# Altium schematic sheet E-05 LPDDR4_x.SchDoc: FRDM-IMX93
size 513 x 386 mm; DrawnBy: FORLINX; Organization: ORGANIZATION; Address1: ADDRESS 1; Address2: ADDRESS 2; Address3: ADDRESS 3; Address4: ADDRESS 4; Revision: -; ENG_APP_DATE: --/--/--; DSN_APP_DATE: --/--/--; CHK_APP_DATE: --/--/--; Classification: Public, Company Internal/Proprietary, Company Confidential,  Company Secret; Page Create Date: March  8, 1995; OrgName: NXP Semiconductor; FIUO: A; OrgAddr1: NO. 192 Liangjing Rd. Pudong New Area, ShangHai; Page Number: 5; PageTitle: LPDDR4/x; Page Size: C; Page Count: 23; Designer: FORLINX; RevCode: B1; Approver: NXP SE; Doc: SCH-94611 PDF: SPF-94611; DsnPath: T:\FILES\Designs\Single Board Computers\i.MX93-FRDM\Design Files\SCH-94611_B1.DSN; SchematicName: FRDM-i.MX 93 Development Board; PageName: E-05 LPDDR4/x; PageSize: C; TopSchematic: True
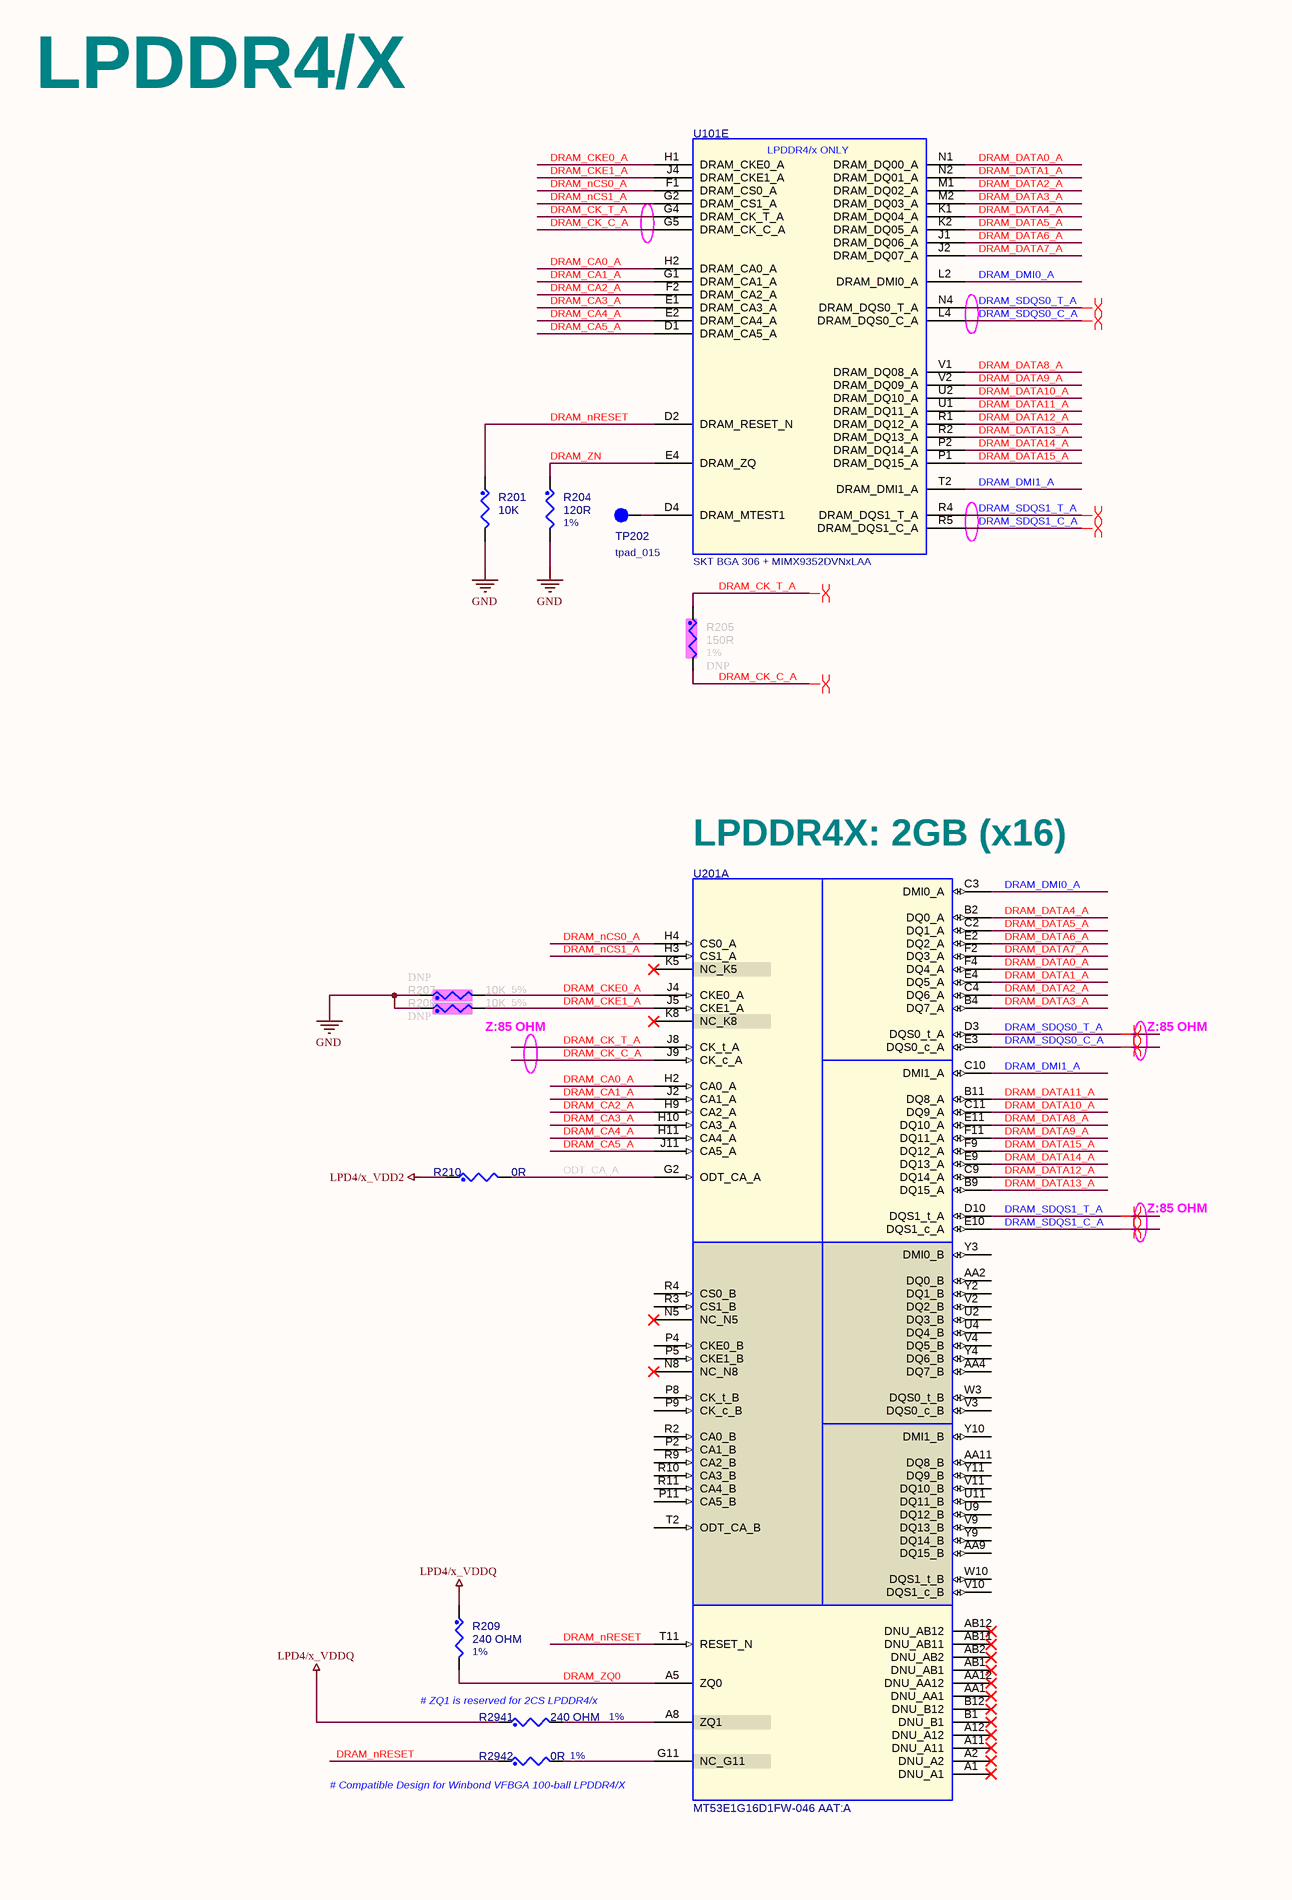
[diagram p0: E-05 LPDDR4_x.SchDoc, left]
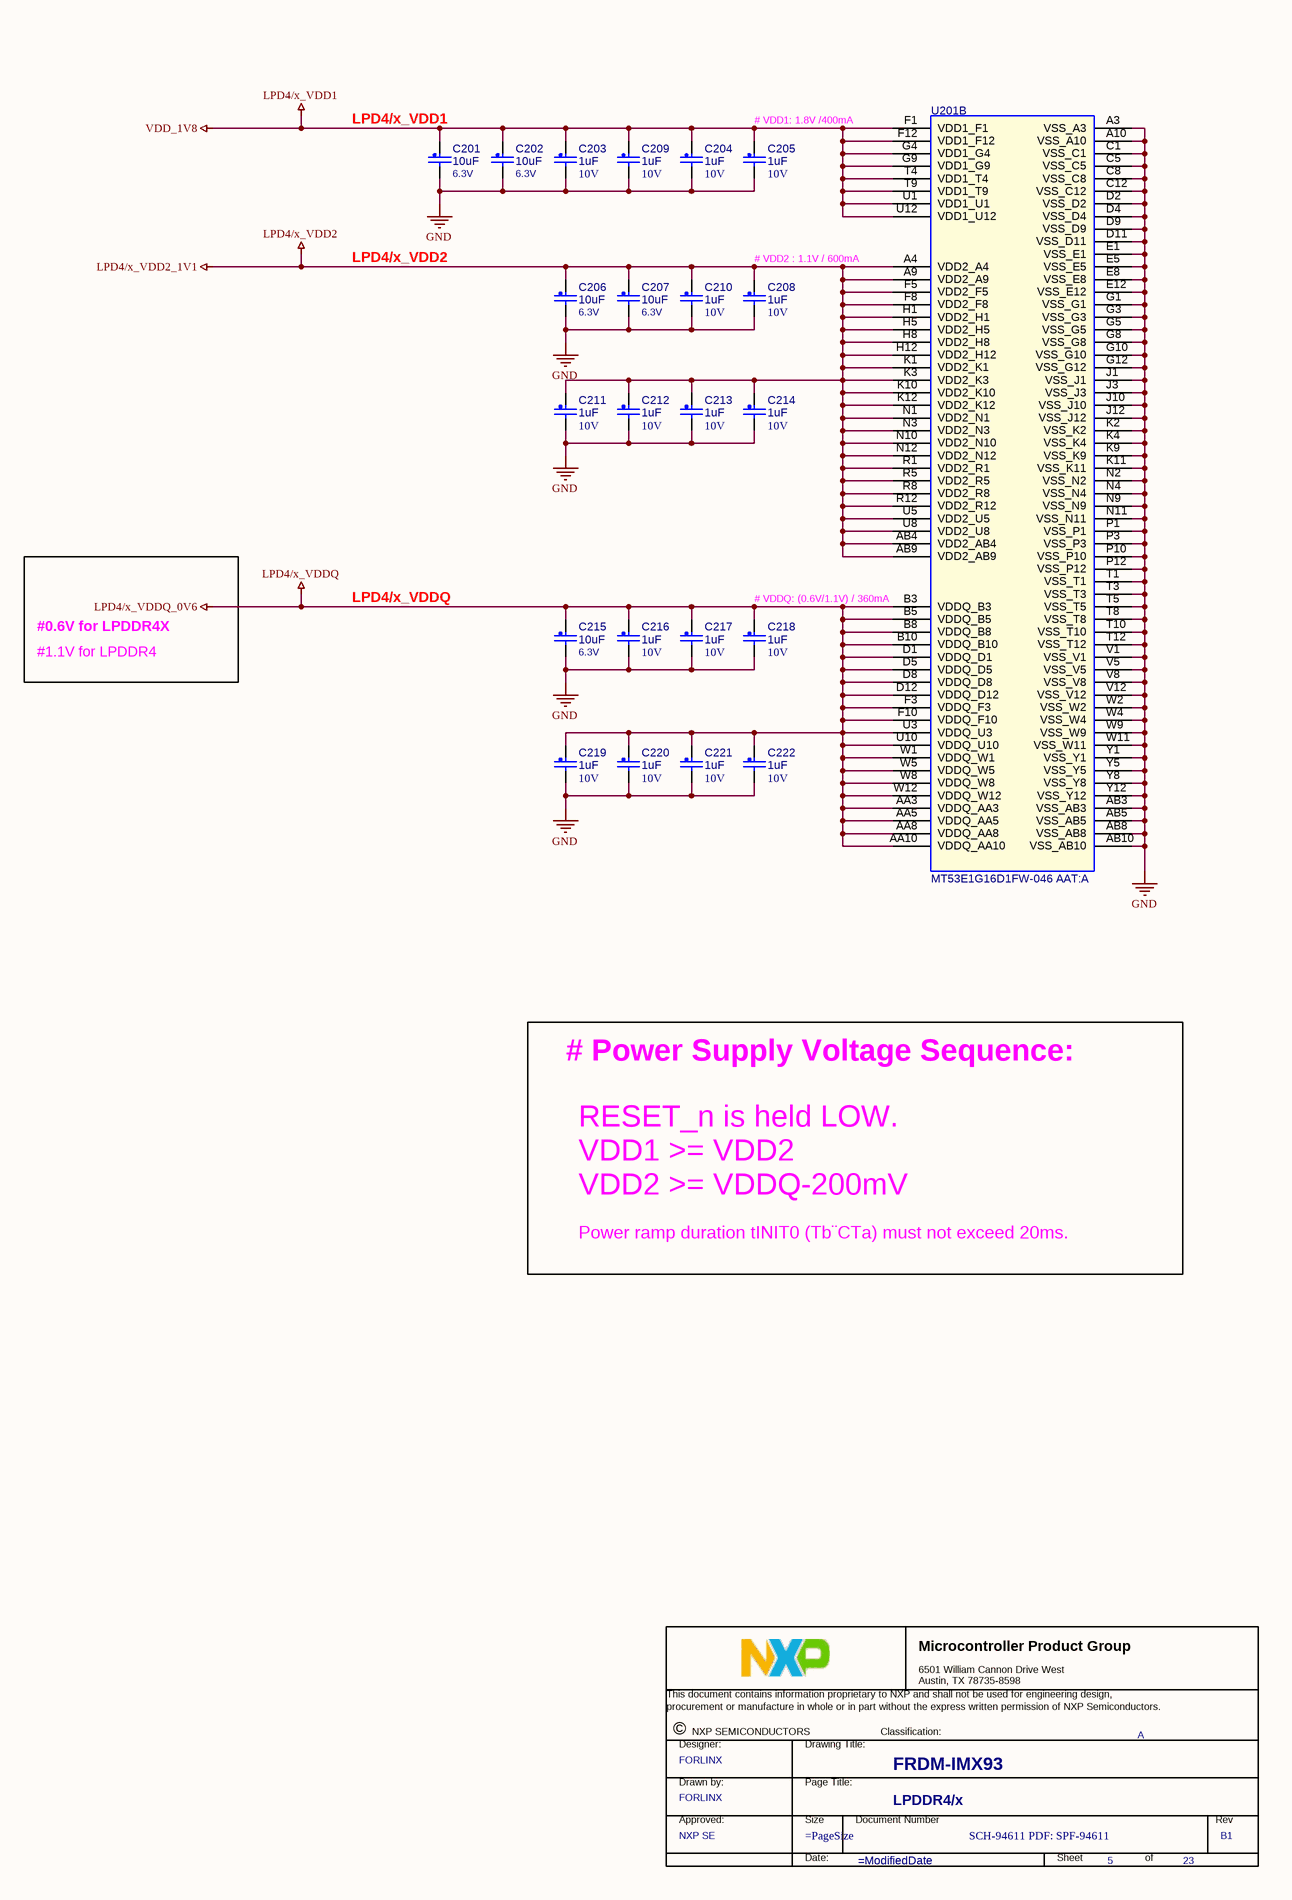
[diagram p1: E-05 LPDDR4_x.SchDoc, right]

## Parts
*  Title: FRDM-IMX93  RevCode: B1  PageTitle: LPDDR4/x  Page Number: 5  Page Count: 23  DrawnBy: FORLINX  Doc: SCH-94611 PDF: SPF-94611  Approver: NXP SE  FIUO: A  (graphical)
C201  10uF  VOLTAGE: 6.3V  [C0402]
C202  10uF  VOLTAGE: 6.3V  [C0402]
C203  1uF  VOLTAGE: 10V  [C0201]
C204  1uF  VOLTAGE: 10V  [C0201]
C205  1uF  VOLTAGE: 10V  [C0201]
C206  10uF  VOLTAGE: 6.3V  [C0402]
C207  10uF  VOLTAGE: 6.3V  [C0402]
C208  1uF  VOLTAGE: 10V  [C0201]
C209  1uF  VOLTAGE: 10V  [C0201]
C210  1uF  VOLTAGE: 10V  [C0201]
C211  1uF  VOLTAGE: 10V  [C0201]
C212  1uF  VOLTAGE: 10V  [C0201]
C213  1uF  VOLTAGE: 10V  [C0201]
C214  1uF  VOLTAGE: 10V  [C0201]
C215  10uF  VOLTAGE: 6.3V  [C0402]
C216  1uF  VOLTAGE: 10V  [C0201]
C217  1uF  VOLTAGE: 10V  [C0201]
C218  1uF  VOLTAGE: 10V  [C0201]
C219  1uF  VOLTAGE: 10V  [C0201]
C220  1uF  VOLTAGE: 10V  [C0201]
C221  1uF  VOLTAGE: 10V  [C0201]
C222  1uF  VOLTAGE: 10V  [C0201]
R201  10K  [R0402]
R204  120R  Tolerance: 1%  [R0402]
R205  150R  ASSY_OPT: DNP  Tolerance: 1%  [R0402]
R207  10K  ASSY_OPT: DNP  Tolerance: 5%  [R0402]
R208  10K  ASSY_OPT: DNP  Tolerance: 5%  [R0402]
R209  240 OHM  Tolerance: 1%  [R0201]
R210  0R  [R0402]
R2941  240 OHM  Tolerance: 1%  [R0201]
R2942  0R  Tolerance: 1%  [R0201]
TP202  TPAD_015  [tpad_015]
U101  SKT BGA 306 + MIMX9352DVNxLAA  [skt_bga306_0p5_sq16p23_elast_nsp]  (part E of 6)
U201  MT53E1G16D1FW-046 AAT:A  [bga200_0p65x0p8_10x14p5]  (parts A,B of 2)

## Nets
GND: C201.2 C202.2 C203.2 C204.2 C205.2 C206.2 C207.2 C208.2 C209.2 C210.2 C211.2 C212.2 C213.2 C214.2 C215.2 C216.2 C217.2 C218.2 C219.2 C220.2 C221.2 C222.2 R201.2 R204.2 R207.1 R208.1 U201.A3(VSS_A3) U201.A10(VSS_A10) U201.AB3(VSS_AB3) U201.AB5(VSS_AB5) U201.AB8(VSS_AB8) U201.AB10(VSS_AB10) U201.C1(VSS_C1) U201.C5(VSS_C5) U201.C8(VSS_C8) U201.C12(VSS_C12) U201.D2(VSS_D2) U201.D4(VSS_D4) U201.D9(VSS_D9) U201.D11(VSS_D11) U201.E1(VSS_E1) U201.E5(VSS_E5) U201.E8(VSS_E8) U201.E12(VSS_E12) U201.G1(VSS_G1) U201.G3(VSS_G3) U201.G5(VSS_G5) U201.G8(VSS_G8) U201.G10(VSS_G10) U201.G12(VSS_G12) U201.J1(VSS_J1) U201.J3(VSS_J3) U201.J10(VSS_J10) U201.J12(VSS_J12) U201.K2(VSS_K2) U201.K4(VSS_K4) U201.K9(VSS_K9) U201.K11(VSS_K11) U201.N2(VSS_N2) U201.N4(VSS_N4) U201.N9(VSS_N9) U201.N11(VSS_N11) U201.P1(VSS_P1) U201.P3(VSS_P3) U201.P10(VSS_P10) U201.P12(VSS_P12) U201.T1(VSS_T1) U201.T3(VSS_T3) U201.T5(VSS_T5) U201.T8(VSS_T8) U201.T10(VSS_T10) U201.T12(VSS_T12) U201.V1(VSS_V1) U201.V5(VSS_V5) U201.V8(VSS_V8) U201.V12(VSS_V12) U201.W2(VSS_W2) U201.W4(VSS_W4) U201.W9(VSS_W9) U201.W11(VSS_W11) U201.Y1(VSS_Y1) U201.Y5(VSS_Y5) U201.Y8(VSS_Y8) U201.Y12(VSS_Y12)
LPD4/x_VDD1: C201.1 C202.1 C203.1 C204.1 C205.1 C209.1 U201.F1(VDD1_F1) U201.F12(VDD1_F12) U201.G4(VDD1_G4) U201.G9(VDD1_G9) U201.T4(VDD1_T4) U201.T9(VDD1_T9) U201.U1(VDD1_U1) U201.U12(VDD1_U12)  [also labelled VDD_1V8]
LPD4/x_VDD2: C206.1 C207.1 C208.1 C210.1 C211.1 C212.1 C213.1 C214.1 R210.1 U201.A4(VDD2_A4) U201.A9(VDD2_A9) U201.AB4(VDD2_AB4) U201.AB9(VDD2_AB9) U201.F5(VDD2_F5) U201.F8(VDD2_F8) U201.H1(VDD2_H1) U201.H5(VDD2_H5) U201.H8(VDD2_H8) U201.H12(VDD2_H12) U201.K1(VDD2_K1) U201.K3(VDD2_K3) U201.K10(VDD2_K10) U201.K12(VDD2_K12) U201.N1(VDD2_N1) U201.N3(VDD2_N3) U201.N10(VDD2_N10) U201.N12(VDD2_N12) U201.R1(VDD2_R1) U201.R5(VDD2_R5) U201.R8(VDD2_R8) U201.R12(VDD2_R12) U201.U5(VDD2_U5) U201.U8(VDD2_U8)  [also labelled LPD4/x_VDD2_1V1]
LPD4/x_VDDQ: C215.1 C216.1 C217.1 C218.1 C219.1 C220.1 C221.1 C222.1 R209.1 R2941.1 U201.AA3(VDDQ_AA3) U201.AA5(VDDQ_AA5) U201.AA8(VDDQ_AA8) U201.AA10(VDDQ_AA10) U201.B3(VDDQ_B3) U201.B5(VDDQ_B5) U201.B8(VDDQ_B8) U201.B10(VDDQ_B10) U201.D1(VDDQ_D1) U201.D5(VDDQ_D5) U201.D8(VDDQ_D8) U201.D12(VDDQ_D12) U201.F3(VDDQ_F3) U201.F10(VDDQ_F10) U201.U3(VDDQ_U3) U201.U10(VDDQ_U10) U201.W1(VDDQ_W1) U201.W5(VDDQ_W5) U201.W8(VDDQ_W8) U201.W12(VDDQ_W12)  [also labelled LPD4/x_VDDQ_0V6]
DRAM_CA0_A: U101.H2(DRAM_CA0_A) U201.H2(CA0_A)
DRAM_CA1_A: U101.G1(DRAM_CA1_A) U201.J2(CA1_A)
DRAM_CA2_A: U101.F2(DRAM_CA2_A) U201.H9(CA2_A)
DRAM_CA3_A: U101.E1(DRAM_CA3_A) U201.H10(CA3_A)
DRAM_CA4_A: U101.E2(DRAM_CA4_A) U201.H11(CA4_A)
DRAM_CA5_A: U101.D1(DRAM_CA5_A) U201.J11(CA5_A)
DRAM_CK_C_A: R205.2 U101.G5(DRAM_CK_C_A) U201.J9(CK_c_A)
DRAM_CK_T_A: R205.1 U101.G4(DRAM_CK_T_A) U201.J8(CK_t_A)
DRAM_CKE0_A: R207.2 U101.H1(DRAM_CKE0_A) U201.J4(CKE0_A)
DRAM_CKE1_A: R208.2 U101.J4(DRAM_CKE1_A) U201.J5(CKE1_A)
DRAM_DATA0_A: U101.N1(DRAM_DQ00_A) U201.F4(DQ4_A)
DRAM_DATA1_A: U101.N2(DRAM_DQ01_A) U201.E4(DQ5_A)
DRAM_DATA2_A: U101.M1(DRAM_DQ02_A) U201.C4(DQ6_A)
DRAM_DATA3_A: U101.M2(DRAM_DQ03_A) U201.B4(DQ7_A)
DRAM_DATA4_A: U101.K1(DRAM_DQ04_A) U201.B2(DQ0_A)
DRAM_DATA5_A: U101.K2(DRAM_DQ05_A) U201.C2(DQ1_A)
DRAM_DATA6_A: U101.J1(DRAM_DQ06_A) U201.E2(DQ2_A)
DRAM_DATA7_A: U101.J2(DRAM_DQ07_A) U201.F2(DQ3_A)
DRAM_DATA8_A: U101.V1(DRAM_DQ08_A) U201.E11(DQ10_A)
DRAM_DATA9_A: U101.V2(DRAM_DQ09_A) U201.F11(DQ11_A)
DRAM_DATA10_A: U101.U2(DRAM_DQ10_A) U201.C11(DQ9_A)
DRAM_DATA11_A: U101.U1(DRAM_DQ11_A) U201.B11(DQ8_A)
DRAM_DATA12_A: U101.R1(DRAM_DQ12_A) U201.C9(DQ14_A)
DRAM_DATA13_A: U101.R2(DRAM_DQ13_A) U201.B9(DQ15_A)
DRAM_DATA14_A: U101.P2(DRAM_DQ14_A) U201.E9(DQ13_A)
DRAM_DATA15_A: U101.P1(DRAM_DQ15_A) U201.F9(DQ12_A)
DRAM_DMI0_A: U101.L2(DRAM_DMI0_A) U201.C3(DMI0_A)
DRAM_DMI1_A: U101.T2(DRAM_DMI1_A) U201.C10(DMI1_A)
DRAM_nCS0_A: U101.F1(DRAM_CS0_A) U201.H4(CS0_A)
DRAM_nCS1_A: U101.G2(DRAM_CS1_A) U201.H3(CS1_A)
DRAM_nRESET: R201.1 R2942.1 U101.D2(DRAM_RESET_N) U201.T11(RESET_N)
DRAM_SDQS0_C_A: U101.L4(DRAM_DQS0_C_A) U201.E3(DQS0_c_A)
DRAM_SDQS0_T_A: U101.N4(DRAM_DQS0_T_A) U201.D3(DQS0_t_A)
DRAM_SDQS1_C_A: U101.R5(DRAM_DQS1_C_A) U201.E10(DQS1_c_A)
DRAM_SDQS1_T_A: U101.R4(DRAM_DQS1_T_A) U201.D10(DQS1_t_A)
DRAM_ZN: R204.1 U101.E4(DRAM_ZQ)
DRAM_ZQ0: R209.2 U201.A5(ZQ0)
ODT_CA_A: R210.2 U201.G2(ODT_CA_A)
NetR2941_2: R2941.2 U201.A8(ZQ1)
NetR2942_2: R2942.2 U201.G11(NC_G11)
NetTP202_1: TP202.1(Pin1) U101.D4(DRAM_MTEST1)

Not connected (* = marked no-connect by the designer): U201 A1(DNU_A1)* A2(DNU_A2)* A11(DNU_A11)* A12(DNU_A12)* AA1(DNU_AA1)* AA2(DQ0_B) AA4(DQ7_B) AA9(DQ15_B) AA11(DQ8_B) AA12(DNU_AA12)* AB1(DNU_AB1)* AB2(DNU_AB2)* AB11(DNU_AB11)* AB12(DNU_AB12)* B1(DNU_B1)* B12(DNU_B12)* K5(NC_K5)* K8(NC_K8)* N5(NC_N5)* N8(NC_N8)* P2(CA1_B) P4(CKE0_B) P5(CKE1_B) P8(CK_t_B) P9(CK_c_B) P11(CA5_B) R2(CA0_B) R3(CS1_B) R4(CS0_B) R9(CA2_B) R10(CA3_B) R11(CA4_B) T2(ODT_CA_B) U2(DQ3_B) U4(DQ4_B) U9(DQ12_B) U11(DQ11_B) V2(DQ2_B) V3(DQS0_c_B) V4(DQ5_B) V9(DQ13_B) V10(DQS1_c_B) V11(DQ10_B) W3(DQS0_t_B) W10(DQS1_t_B) Y2(DQ1_B) Y3(DMI0_B) Y4(DQ6_B) Y9(DQ14_B) Y10(DMI1_B) Y11(DQ9_B)

## Layout directives
differential pair: DRAM_CK_C_A, DRAM_CK_T_A, DRAM_SDQS0_C_A, DRAM_SDQS0_T_A, DRAM_SDQS1_C_A, DRAM_SDQS1_T_A

## Notes on the sheet
- LPDDR4/X
- (near C205) # VDD1: 1.8V /400mA
- (near C208) # VDD2 : 1.1V / 600mA
- #0.6V for LPDDR4X
- # VDDQ: (0.6V/1.1V) / 360mA
- #1.1V for LPDDR4
- (near U201) LPDDR4X: 2GB (x16)
- Z:85 OHM
- # Power Supply Voltage Sequence:
- RESET_n is held LOW.
  VDD1 >= VDD2
  VDD2 >= VDDQ-200mV
- Power ramp duration tINIT0 (Tb¨CTa) must not exceed 20ms.
- (near R2941) # ZQ1 is reserved for 2CS LPDDR4/x
- (near R2942) # Compatible Design for Winbond VFBGA 100-ball LPDDR4/X
- DWG. NO.
- REV.
- SHT.
- REVISION
- DESCRIPTION
- DATE
- APPROVED
- ENG:
- APPROVALS
- quilter.ai <http://quilter.ai>
- DSN:
- CHK:
- REFERENCE DOCUMENTS
- TITLE
- PROJECT
- BOM:
- FAB DWG:
- PCB DWG:
- ASSY DWG:
- SIZE
- FILE NAME
- C
- DWG NO.
- SHEET
- OF
- REV
- (in symbol MIMX9352DVNxLAA, part E) LPDDR4/x ONLY
- (in symbol TitleBlock_MCPG) Microcontroller Product Group; 6501 William Cannon Drive West / Austin, TX 78735-8598; This document contains information proprietary to NXP and shall not be used for engineering design,; procurement or manufacture in whole or in part without the express written permission of NXP Semiconductors.; ©; NXP SEMICONDUCTORS; Classification:; Designer:; Drawing Title:; Drawn by:; Page Title:; Approved:; Size; Document Number; Rev; Date:; Sheet; of

## Library data of the parts
* = TitleBlock_MCPG: Classification: Public, Company Internal/Proprietary, Company Confidential,  Company Secret; OrgName: NXP Semiconductor; OrgAddr1: NO. 192 Liangjing Rd. Pudong New Area, ShangHai; Page Size: =PageSize; Page Create Date: March  8, 1995; Designer: FORLINX; Page Modify Date: =ModifiedDate
C201 = CAP_NP: 0402,10uF,6.3V,+/-20%,X5R; Part Reference: C201; CLASS: DISCRETE; FPLIST: CC0402_25,CC0402_HD,0402_CC; CAD_APPROVED: Yes; MFG_PN01: 0402X106M6R3NT; MFG_NAME01: FENGHUA; Tolerance: 20%; Value: 10uF; PCB Footprint: C0402; HEIGHT: 0.65 MM; ROHS: Yes
C202 = CAP_NP: 0402,10uF,6.3V,+/-20%,X5R; Part Reference: C202; CLASS: DISCRETE; FPLIST: CC0402_25,CC0402_HD,0402_CC; CAD_APPROVED: Yes; MFG_PN01: 0402X106M6R3NT; MFG_NAME01: FENGHUA; Tolerance: 20%; Value: 10uF; PCB Footprint: C0402; HEIGHT: 0.65 MM; ROHS: Yes
C203 = CAP_NP: 0201,1uF,10V,+/-20%,X5R; Part Reference: C203; CLASS: DISCRETE; FPLIST: CC0201,CC0201_HD,0201_CC,cc_0201_cir; CAD_APPROVED: Yes; MFG_PN01: CL03A105MP3NSNC; MFG_NAME01: SAMSUNG; Tolerance: 10%; Temp Range: -55¡ãC to 85¡ãC; Value: 1uF; PCB Footprint: C0201; Package Type: SMD/SMT; Package Size: 0201 (0603 Metric); HEIGHT: 0.35MM; ROHS: Yes
C204 = CAP_NP: 0201,1uF,10V,+/-20%,X5R; Part Reference: C204; CLASS: DISCRETE; Tolerance: 10%; MFG_NAME01: SAMSUNG; MFG_PN01: CL03A105MP3NSNC; CAD_APPROVED: Yes; FPLIST: CC0201,CC0201_HD,0201_CC,cc_0201_cir; Temp Range: -55¡ãC to 85¡ãC; Value: 1uF; PCB Footprint: C0201; Package Type: SMD/SMT; Package Size: 0201 (0603 Metric); ROHS: Yes; HEIGHT: 0.35MM
C205 = CAP_NP: 0201,1uF,10V,+/-20%,X5R; Part Reference: C205; CLASS: DISCRETE; FPLIST: CC0201,CC0201_HD,0201_CC,cc_0201_cir; CAD_APPROVED: Yes; MFG_PN01: CL03A105MP3NSNC; MFG_NAME01: SAMSUNG; Tolerance: 10%; Temp Range: -55¡ãC to 85¡ãC; Value: 1uF; PCB Footprint: C0201; Package Type: SMD/SMT; Package Size: 0201 (0603 Metric); HEIGHT: 0.35MM; ROHS: Yes
C206 = CAP_NP: 0402,10uF,6.3V,+/-20%,X5R; Part Reference: C206; CLASS: DISCRETE; FPLIST: CC0402_25,CC0402_HD,0402_CC; CAD_APPROVED: Yes; MFG_PN01: 0402X106M6R3NT; MFG_NAME01: FENGHUA; Tolerance: 20%; Value: 10uF; PCB Footprint: C0402; HEIGHT: 0.65 MM; ROHS: Yes
C207 = CAP_NP: 0402,10uF,6.3V,+/-20%,X5R; Part Reference: C207; CLASS: DISCRETE; FPLIST: CC0402_25,CC0402_HD,0402_CC; CAD_APPROVED: Yes; MFG_PN01: 0402X106M6R3NT; MFG_NAME01: FENGHUA; Tolerance: 20%; Value: 10uF; PCB Footprint: C0402; HEIGHT: 0.65 MM; ROHS: Yes
C208 = CAP_NP: 0201,1uF,10V,+/-20%,X5R; Part Reference: C208; CLASS: DISCRETE; Tolerance: 10%; MFG_NAME01: SAMSUNG; MFG_PN01: CL03A105MP3NSNC; CAD_APPROVED: Yes; FPLIST: CC0201,CC0201_HD,0201_CC,cc_0201_cir; Temp Range: -55¡ãC to 85¡ãC; Value: 1uF; PCB Footprint: C0201; Package Type: SMD/SMT; Package Size: 0201 (0603 Metric); ROHS: Yes; HEIGHT: 0.35MM
C209 = CAP_NP: 0201,1uF,10V,+/-20%,X5R; Part Reference: C209; CLASS: DISCRETE; Tolerance: 10%; MFG_NAME01: SAMSUNG; MFG_PN01: CL03A105MP3NSNC; CAD_APPROVED: Yes; FPLIST: CC0201,CC0201_HD,0201_CC,cc_0201_cir; Temp Range: -55¡ãC to 85¡ãC; Value: 1uF; PCB Footprint: C0201; Package Type: SMD/SMT; Package Size: 0201 (0603 Metric); ROHS: Yes; HEIGHT: 0.35MM
C210 = CAP_NP: 0201,1uF,10V,+/-20%,X5R; Part Reference: C210; CLASS: DISCRETE; Tolerance: 10%; MFG_NAME01: SAMSUNG; MFG_PN01: CL03A105MP3NSNC; CAD_APPROVED: Yes; FPLIST: CC0201,CC0201_HD,0201_CC,cc_0201_cir; Temp Range: -55¡ãC to 85¡ãC; Value: 1uF; PCB Footprint: C0201; Package Type: SMD/SMT; Package Size: 0201 (0603 Metric); ROHS: Yes; HEIGHT: 0.35MM
C211 = CAP_NP: 0201,1uF,10V,+/-20%,X5R; Part Reference: C211; CLASS: DISCRETE; FPLIST: CC0201,CC0201_HD,0201_CC,cc_0201_cir; CAD_APPROVED: Yes; MFG_PN01: CL03A105MP3NSNC; MFG_NAME01: SAMSUNG; Tolerance: 10%; Temp Range: -55¡ãC to 85¡ãC; Value: 1uF; PCB Footprint: C0201; Package Type: SMD/SMT; Package Size: 0201 (0603 Metric); HEIGHT: 0.35MM; ROHS: Yes
C212 = CAP_NP: 0201,1uF,10V,+/-20%,X5R; Part Reference: C212; CLASS: DISCRETE; FPLIST: CC0201,CC0201_HD,0201_CC,cc_0201_cir; CAD_APPROVED: Yes; MFG_PN01: CL03A105MP3NSNC; MFG_NAME01: SAMSUNG; Tolerance: 10%; Temp Range: -55¡ãC to 85¡ãC; Value: 1uF; PCB Footprint: C0201; Package Type: SMD/SMT; Package Size: 0201 (0603 Metric); HEIGHT: 0.35MM; ROHS: Yes
C213 = CAP_NP: 0201,1uF,10V,+/-20%,X5R; Part Reference: C213; CLASS: DISCRETE; FPLIST: CC0201,CC0201_HD,0201_CC,cc_0201_cir; CAD_APPROVED: Yes; MFG_PN01: CL03A105MP3NSNC; MFG_NAME01: SAMSUNG; Tolerance: 10%; Temp Range: -55¡ãC to 85¡ãC; Value: 1uF; PCB Footprint: C0201; Package Type: SMD/SMT; Package Size: 0201 (0603 Metric); HEIGHT: 0.35MM; ROHS: Yes
C214 = CAP_NP: 0201,1uF,10V,+/-20%,X5R; Part Reference: C214; CLASS: DISCRETE; Tolerance: 10%; MFG_NAME01: SAMSUNG; MFG_PN01: CL03A105MP3NSNC; CAD_APPROVED: Yes; FPLIST: CC0201,CC0201_HD,0201_CC,cc_0201_cir; Temp Range: -55¡ãC to 85¡ãC; Value: 1uF; PCB Footprint: C0201; Package Type: SMD/SMT; Package Size: 0201 (0603 Metric); ROHS: Yes; HEIGHT: 0.35MM
C215 = CAP_NP: 0402,10uF,6.3V,+/-20%,X5R; Part Reference: C215; CLASS: DISCRETE; FPLIST: CC0402_25,CC0402_HD,0402_CC; CAD_APPROVED: Yes; MFG_PN01: 0402X106M6R3NT; MFG_NAME01: FENGHUA; Tolerance: 20%; Value: 10uF; PCB Footprint: C0402; HEIGHT: 0.65 MM; ROHS: Yes
C216 = CAP_NP: 0201,1uF,10V,+/-20%,X5R; Part Reference: C216; CLASS: DISCRETE; FPLIST: CC0201,CC0201_HD,0201_CC,cc_0201_cir; CAD_APPROVED: Yes; MFG_PN01: CL03A105MP3NSNC; MFG_NAME01: SAMSUNG; Tolerance: 10%; Temp Range: -55¡ãC to 85¡ãC; Value: 1uF; PCB Footprint: C0201; Package Type: SMD/SMT; Package Size: 0201 (0603 Metric); HEIGHT: 0.35MM; ROHS: Yes
C217 = CAP_NP: 0201,1uF,10V,+/-20%,X5R; Part Reference: C217; CLASS: DISCRETE; Tolerance: 10%; MFG_NAME01: SAMSUNG; MFG_PN01: CL03A105MP3NSNC; CAD_APPROVED: Yes; FPLIST: CC0201,CC0201_HD,0201_CC,cc_0201_cir; Temp Range: -55¡ãC to 85¡ãC; Value: 1uF; PCB Footprint: C0201; Package Type: SMD/SMT; Package Size: 0201 (0603 Metric); ROHS: Yes; HEIGHT: 0.35MM
C218 = CAP_NP: 0201,1uF,10V,+/-20%,X5R; Part Reference: C218; CLASS: DISCRETE; FPLIST: CC0201,CC0201_HD,0201_CC,cc_0201_cir; CAD_APPROVED: Yes; MFG_PN01: CL03A105MP3NSNC; MFG_NAME01: SAMSUNG; Tolerance: 10%; Temp Range: -55¡ãC to 85¡ãC; Value: 1uF; PCB Footprint: C0201; Package Type: SMD/SMT; Package Size: 0201 (0603 Metric); HEIGHT: 0.35MM; ROHS: Yes
C219 = CAP_NP: 0201,1uF,10V,+/-20%,X5R; Part Reference: C219; CLASS: DISCRETE; Tolerance: 10%; MFG_NAME01: SAMSUNG; MFG_PN01: CL03A105MP3NSNC; CAD_APPROVED: Yes; FPLIST: CC0201,CC0201_HD,0201_CC,cc_0201_cir; Temp Range: -55¡ãC to 85¡ãC; Value: 1uF; PCB Footprint: C0201; ROHS: Yes; HEIGHT: 0.35MM; Package Size: 0201 (0603 Metric); Package Type: SMD/SMT
C220 = CAP_NP: 0201,1uF,10V,+/-20%,X5R; Part Reference: C220; CLASS: DISCRETE; FPLIST: CC0201,CC0201_HD,0201_CC,cc_0201_cir; CAD_APPROVED: Yes; MFG_PN01: CL03A105MP3NSNC; MFG_NAME01: SAMSUNG; Tolerance: 10%; Temp Range: -55¡ãC to 85¡ãC; Value: 1uF; PCB Footprint: C0201; HEIGHT: 0.35MM; ROHS: Yes; Package Size: 0201 (0603 Metric); Package Type: SMD/SMT
C221 = CAP_NP: 0201,1uF,10V,+/-20%,X5R; Part Reference: C221; CLASS: DISCRETE; Tolerance: 10%; MFG_NAME01: SAMSUNG; MFG_PN01: CL03A105MP3NSNC; CAD_APPROVED: Yes; FPLIST: CC0201,CC0201_HD,0201_CC,cc_0201_cir; Temp Range: -55¡ãC to 85¡ãC; Value: 1uF; PCB Footprint: C0201; ROHS: Yes; HEIGHT: 0.35MM; Package Size: 0201 (0603 Metric); Package Type: SMD/SMT
C222 = CAP_NP: 0201,1uF,10V,+/-20%,X5R; Part Reference: C222; CLASS: DISCRETE; FPLIST: CC0201,CC0201_HD,0201_CC,cc_0201_cir; CAD_APPROVED: Yes; MFG_PN01: CL03A105MP3NSNC; MFG_NAME01: SAMSUNG; Tolerance: 10%; Temp Range: -55¡ãC to 85¡ãC; Value: 1uF; PCB Footprint: C0201; HEIGHT: 0.35MM; ROHS: Yes; Package Size: 0201 (0603 Metric); Package Type: SMD/SMT
R201 = RES: 0402,10K,+/-1%; Part Reference: R201; CLASS: DISCRETE; FPLIST: RC0402_25,RC0402_HD,0402_CC; CAD_APPROVED: Yes; MFG_PN01: RC-02W1002FT; MFG_NAME01: FENGHUA; Tolerance: 5%; Value: 10K; PCB Footprint: R0402; HEIGHT: 0.4 MM; ROHS: Yes
R204 = RES: 0402,120Ohm,+/-1%; Part Reference: R204; CLASS: DISCRETE; FPLIST: RC0402_25,RC0402_HD,0402_CC; CAD_APPROVED: Yes; VOLTAGE: 1/10W; Temp Range: -55¡ãC ~ 155¡ãC; MFG_NAME01: FENGHUA; MFG_PN01: RC-02K1200FT; Value: 120R; PCB Footprint: R0402; HEIGHT: 0.4MM; ROHS: Yes
R205 = RES: 0402,150Ohm,+/-5%; Part Reference: R205; CLASS: DISCRETE; FPLIST: RC0402_25,RC0402_HD,0402_CC; CAD_APPROVED: Yes; MFG_PN01: RC-02W151JT; MFG_NAME01: FENGHUA; Value: 150R; PCB Footprint: R0402; HEIGHT: 0.4MM; ROHS: Yes
R207 = RES: 0402,10K,+/-1%; Part Reference: R207; CLASS: DISCRETE; FPLIST: RC0402_25,RC0402_HD,0402_CC; CAD_APPROVED: Yes; MFG_PN01: RC-02W1002FT; MFG_NAME01: FENGHUA; Value: 10K; PCB Footprint: R0402; ROHS: Yes; HEIGHT: 0.4 MM
R208 = RES: 0402,10K,+/-1%; Part Reference: R208; CLASS: DISCRETE; MFG_NAME01: FENGHUA; MFG_PN01: RC-02W1002FT; CAD_APPROVED: Yes; FPLIST: RC0402_25,RC0402_HD,0402_CC; Value: 10K; PCB Footprint: R0402; HEIGHT: 0.4 MM; ROHS: Yes
R209 = RES: 0201,240Ohm,+/-1%; Part Reference: R209; CLASS: DISCRETE; Temp Range: -55¡ãC ~ 125¡ãC; VOLTAGE: 25V; FPLIST: CC0201,CC0201_HD,0201_CC; CAD_APPROVED: Yes; MFG_PN01: RC-01W2400FT; MFG_NAME01: FENGHUA; Value: 240 OHM; PCB Footprint: R0201; HEIGHT: 0.26MM; Temp_Range: -55¡ãC ~ 125¡ãC; ROHS: Yes
R210 = RES: 0402,0Ohm,+/-1%; Part Reference: R210; CLASS: DISCRETE; VOLTAGE: 1/16W; Tolerance: 5%; MFG_NAME01: FENGHUA; MFG_PN01: RC-02000FT; CAD_APPROVED: Yes; FPLIST: RC0402_25,RC0402_HD,RC0402_X2,0402_CC; Value: 0R; PCB Footprint: R0402; ROHS: Yes; HEIGHT: 0.45 MM
R2941 = RES: 0201,240Ohm,+/-1%; Part Reference: R2941; CLASS: DISCRETE; MFG_NAME01: FENGHUA; MFG_PN01: RC-01W2400FT; Temp_Range: -55¡ãC ~ 125¡ãC; CAD_APPROVED: Yes; FPLIST: CC0201,CC0201_HD,0201_CC; VOLTAGE: 25V; Value: 240 OHM; PCB Footprint: R0201; ROHS: Yes; HEIGHT: 0.26MM; Temp Range: -55¡ãC ~ 125¡ãC
R2942 = RES: 0201,0Ohm,+/-5%; Part Reference: R2942; CLASS: DISCRETE; MFG_NAME01: FENGHUA; MFG_PN01: RC-01000JT; Temp_Range: -55¡ãC ~ 125¡ãC; CAD_APPROVED: Yes; FPLIST: CC0201,CC0201_HD,0201_CC; VOLTAGE: 25V; Value: 0R; PCB Footprint: R0201; ROHS: Yes; HEIGHT: 0.26MM; Temp Range: -55¡ãC ~ 125¡ãC
TP202 = TESTLOOP: no part to order; Part Reference: TP202; CLASS: IO; ASSY_OPT: DNP; CAD_APPROVED: Yes; MFG_PN01: NOT A COMPONENT; PCB Footprint: tpad_015; HEIGHT: 0.1MM; ROHS: Yes; MFG_NAME01: NOT A COMPONENT
U101 = MIMX9352DVNxLAA: MIMX9352CVVXMAB,-40~105+C,11*11mm,0.5mm pitch,FCBGA,A,306pin,1.7GHz; Part Reference: U101; CLASS: IC; FPLIST: skt_bga306_0p5_sq16p23_elast,skt_bga306_0p5_sq16p23_elast_nsp; CAD_APPROVED: Yes; MFG_NAME01: NXP SEMICONDUCTORS; Value: SKT BGA 306 + MIMX9352DVNxLAA; PCB Footprint: skt_bga306_0p5_sq16p23_elast_nsp; HEIGHT: 10.03MM; ROHS: Yes; MFG_PN01: MIMX9352DVNxLAA
U201 = MT53B768M32D4NQ_200P: MT53E1G16D1ZW-046 WT:C,200-ball TFBGA,10x14.5,LPDDR4/LPDDR4x,2GB,-25+C~85+C,code:D8FCP; Part Reference: U201; CLASS: IC; SPLIT_INST: TRUE; SWAP_INFO: (S1+S2); MFG_NAME01: MICRON; Temp_Range: -40C to +105C¡ãC; PRE_APN: 334-77894; CAD_APPROVED: Yes; VOLTAGE: 1.1V; Value: MT53E1G16D1FW-046 AAT:A; MFG_PN01: MT53E1G16D1ZW-046 WT:C; ROHS: Yes; HEIGHT: 0.95MM; Temp Range: -40C to +105C¡ãC; PCB Footprint: bga200_0p65x0p8_10x14p5